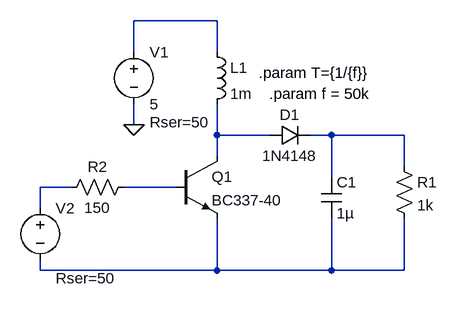
[diagram p0: schematic Draft1.asc]
Draft1.asc, the LTspice schematic file:
Version 4
SHEET 1 880 680
WIRE 192 -16 64 -16
WIRE 64 32 64 -16
WIRE 192 32 192 -16
WIRE 64 144 64 112
WIRE 192 160 192 112
WIRE 272 160 192 160
WIRE 368 160 336 160
WIRE 480 160 368 160
WIRE 192 192 192 160
WIRE 480 208 480 160
WIRE 368 224 368 160
WIRE -32 240 -80 240
WIRE 128 240 48 240
WIRE -80 272 -80 240
WIRE -80 368 -80 352
WIRE 192 368 192 288
WIRE 192 368 -80 368
WIRE 368 368 368 288
WIRE 368 368 192 368
WIRE 480 368 480 288
WIRE 480 368 368 368
FLAG 64 144 0
SYMBOL ind 176 16 R0
SYMATTR InstName L1
SYMATTR Value 1m
SYMBOL diode 272 176 R270
WINDOW 0 32 32 VTop 2
WINDOW 3 0 32 VBottom 2
SYMATTR InstName D1
SYMATTR Value 1N4148
SYMBOL cap 352 224 R0
SYMATTR InstName C1
SYMATTR Value 1µ
SYMBOL res 464 192 R0
SYMATTR InstName R1
SYMATTR Value 1k
SYMBOL npn 128 192 R0
SYMATTR InstName Q1
SYMATTR Value BC337-40
SYMBOL res 64 224 R90
WINDOW 0 0 56 VBottom 2
WINDOW 3 32 56 VTop 2
SYMATTR InstName R2
SYMATTR Value 150
SYMBOL voltage 64 16 R0
WINDOW 123 0 0 Left 0
WINDOW 39 24 124 Left 2
SYMATTR InstName V1
SYMATTR Value 5
SYMATTR SpiceLine Rser=50
SYMBOL voltage -80 256 R0
WINDOW 123 0 0 Left 0
WINDOW 39 24 124 Left 2
SYMATTR InstName V2
SYMATTR Value ""
SYMATTR SpiceLine Rser=50
TEXT 272 96 Left 2 !.param f = 50k
TEXT 256 64 Left 2 !.param T={1/{f}}

The netlist it stands for:
* Draft1.asc
L1 N001 N002 1m
D1 N002 N003 1N4148
C1 N003 N006 1µ
R1 N003 N006 1k
Q1 N002 N005 N006 0 BC337-40
R2 N005 N004 150
V1 N001 0 5 Rser=50
V2 N004 N006 Rser=50
.model D D
.lib standard.dio
.model NPN NPN
.model PNP PNP
.lib standard.bjt
.param f = 50k
.param T={1/{f}}
.backanno
.end